# EAGLE design TokyoTime (EAGLE 5.11)
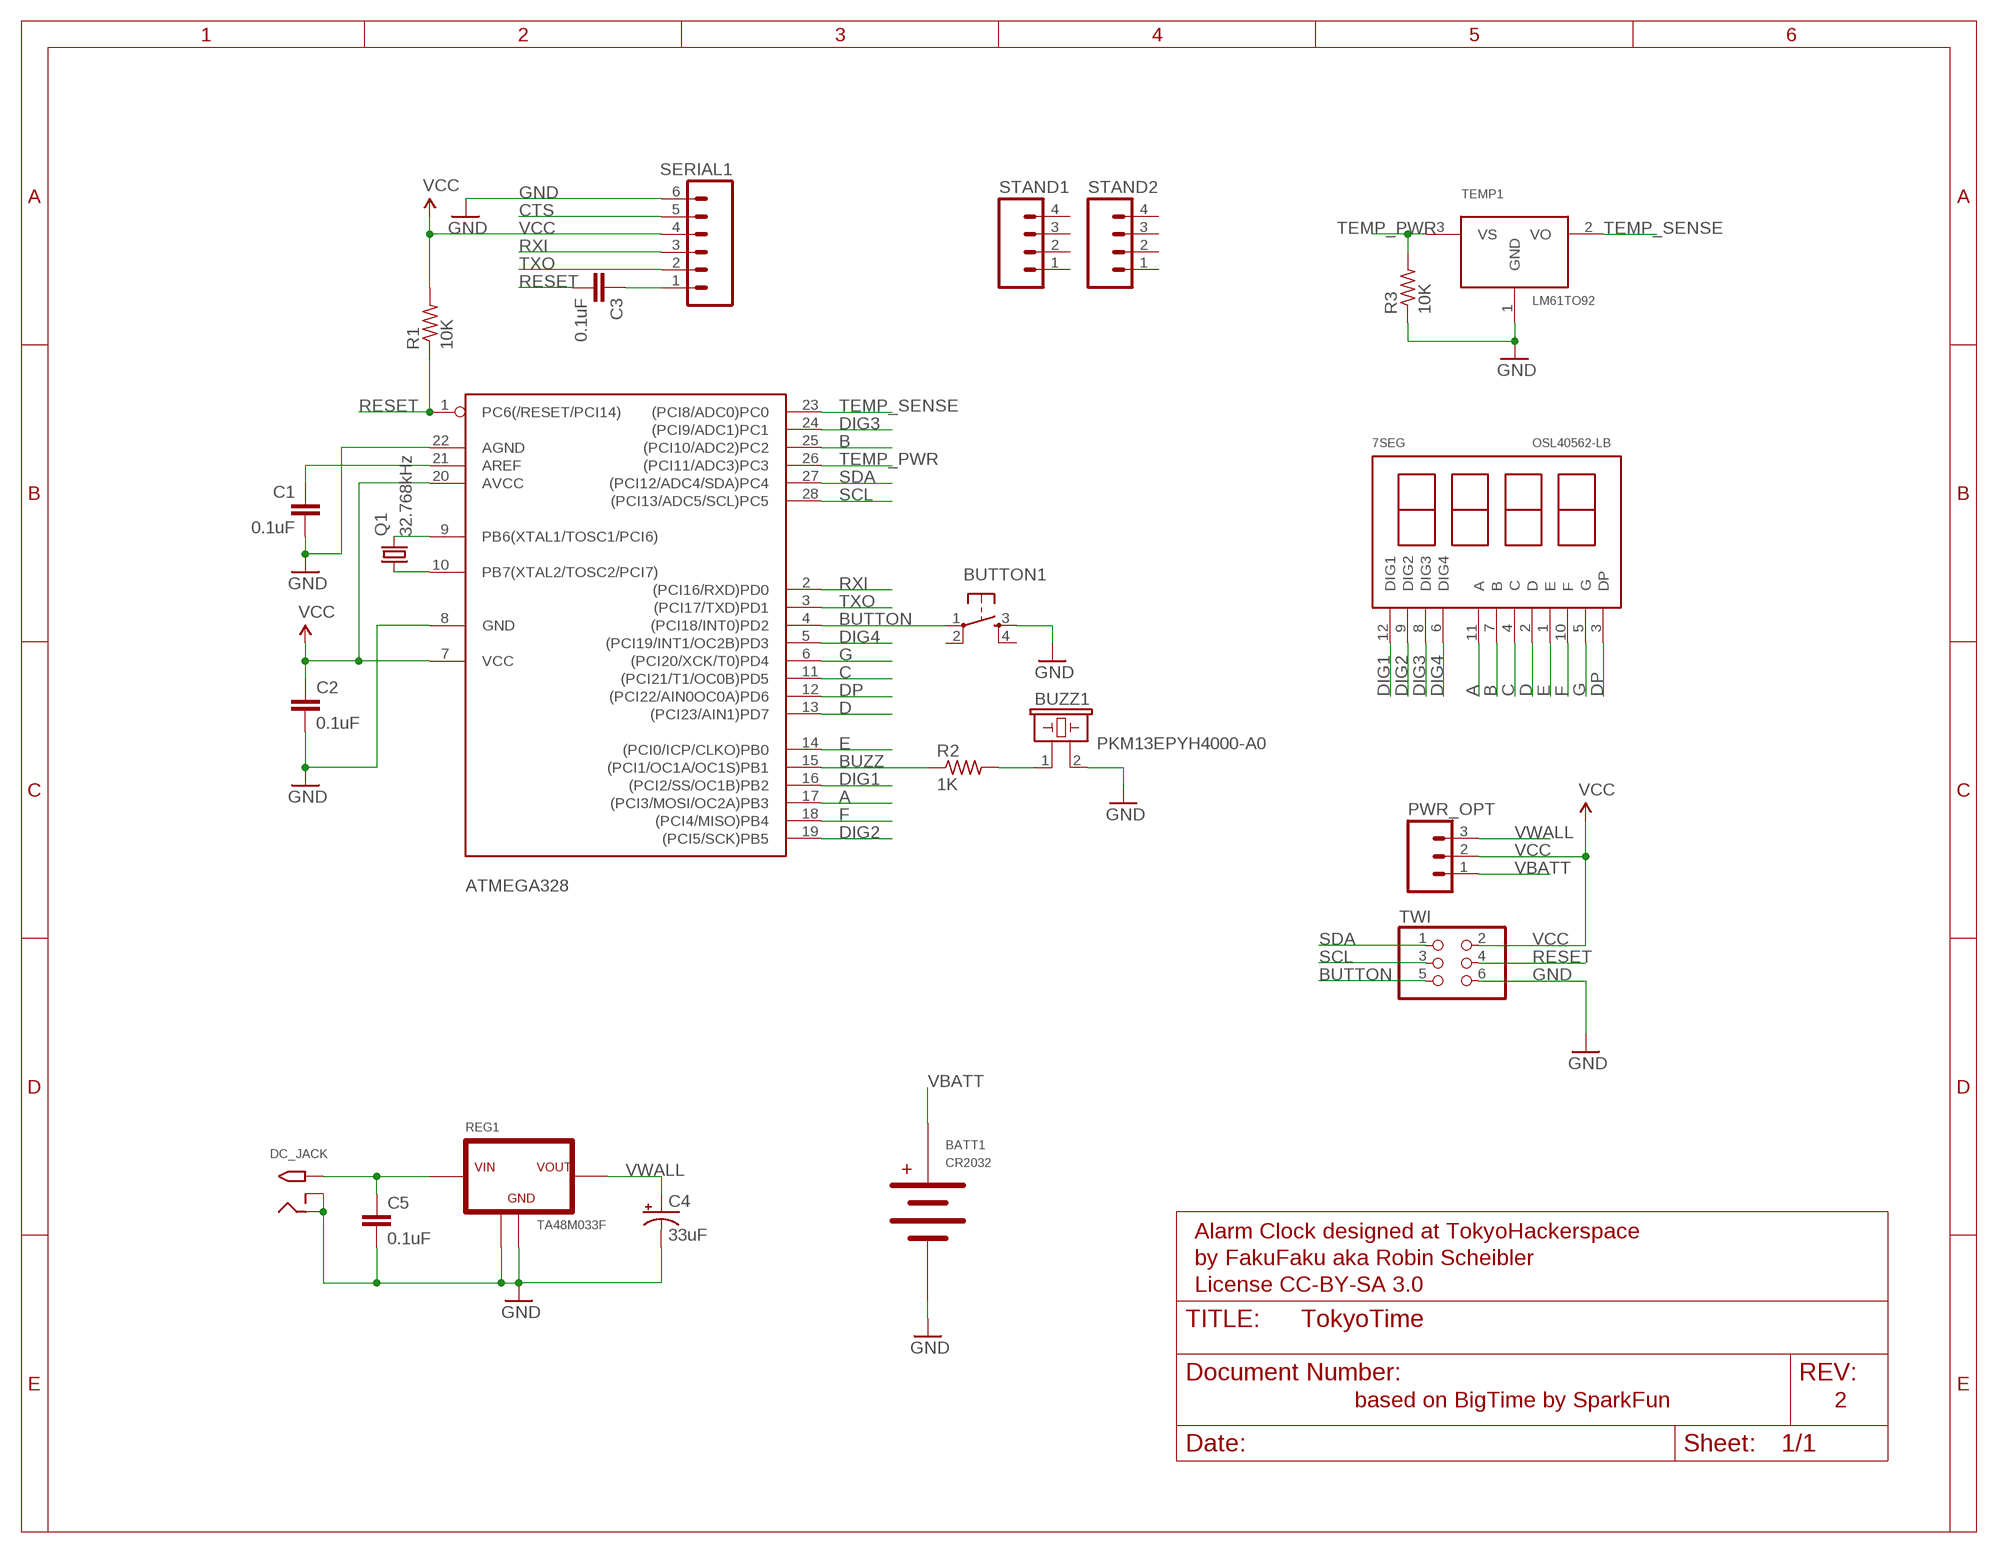
[diagram p0: schematic, sheet 1]

## Parts
7SEG  OSL40562-LB  7SEG  [OSL40562]
ATMEGA328  ATMEGA168-20P  [DIL28-3]
BATT1  CR2032  BATTERY-HOLDER  [CR2032-HOLDER-20MM]
BUTTON1  TAC_SWITCHPTH  [TACTILE-PTH]
BUZZ1  PKM13EPYH4000-A0  BUZZER13MM  [PIEZO-MURATA-13MM]
C1  0.1uF  CAPPTH  [CAP-PTH-SMALL]
C2  0.1uF  CAPPTH  [CAP-PTH-SMALL]
C3  0.1uF  CAPPTH  [CAP-PTH-SMALL]
C4  33uF  CAP_POLPTH2  [CPOL-RADIAL-10UF-25V]
C5  0.1uF  CAPPTH  [CAP-PTH-SMALL]
DC_JACK  2.1MMJACKTHM  [PJ-102A]
PWR_OPT  M03PTH  [1X03]
Q1  32.768kHz  CRYSTAL8X3  [CRYSTAL-8X3-TH]
R1  10K  R-US_0207/10  [0207/10]
R2  1K  R-US_0207/10  [0207/10]
R3  10K  R-US_0207/10  [0207/10]
REG1  TA48M033F  REGULATOR  [HSIP3-P-2.30B]
SERIAL1  M06SIP  [1X06]
STAND1  M04PTH  [1X04]
STAND2  M04PTH  [1X04]
TEMP1  LM61TO92  [TO92-]
TWI  PINHD-2X3  [2X03]

## Nets
A: 7SEG.11(A) ATMEGA328.17((PCI3/MOSI/OC2A)PB3)
B: 7SEG.7(B) ATMEGA328.25((PCI10/ADC2)PC2)
BUTTON: ATMEGA328.4((PCI18/INT0)PD2) BUTTON1.1 TWI.5
BUZZ: ATMEGA328.15((PCI1/OC1A/OC1S)PB1) R2.1
C: 7SEG.4(C) ATMEGA328.11((PCI21/T1/OC0B)PD5)
CTS: SERIAL1.5
D: 7SEG.2(D) ATMEGA328.13((PCI23/AIN1)PD7)
DIG1: 7SEG.12(DIG1) ATMEGA328.16((PCI2/SS/OC1B)PB2)
DIG2: 7SEG.9(DIG2) ATMEGA328.19((PCI5/SCK)PB5)
DIG3: 7SEG.8(DIG3) ATMEGA328.24((PCI9/ADC1)PC1)
DIG4: 7SEG.6(DIG4) ATMEGA328.5((PCI19/INT1/OC2B)PD3)
DP: 7SEG.3(DP) ATMEGA328.12((PCI22/AIN0OC0A)PD6)
E: 7SEG.1(E) ATMEGA328.14((PCI0/ICP/CLKO)PB0)
F: 7SEG.10(F) ATMEGA328.18((PCI4/MISO)PB4)
G: 7SEG.5(G) ATMEGA328.6((PCI20/XCK/T0)PD4)
GND: ATMEGA328.8(GND) ATMEGA328.22(AGND) BATT1.MINUS BUTTON1.3 BUZZ1.2 C1.2 C2.2 C4.2(-) C5.2 DC_JACK.RING DC_JACK.RING_SW R3.1 REG1.2(GND) REG1.HEATSINK(GND) SERIAL1.6 TEMP1.1(GND) TWI.6
N$1: ATMEGA328.9(PB6(XTAL1/TOSC1/PCI6)) Q1.2
N$2: ATMEGA328.10(PB7(XTAL2/TOSC2/PCI7)) Q1.1
N$3: C5.1 DC_JACK.TIP REG1.1(VIN)
N$4: ATMEGA328.21(AREF) C1.1
N$7: C3.1 SERIAL1.1
N$13: BUZZ1.1 R2.2
RESET: ATMEGA328.1(PC6(/RESET/PCI14)) C3.2 R1.1 TWI.4
RXI: ATMEGA328.2((PCI16/RXD)PD0) SERIAL1.3
SCL: ATMEGA328.28((PCI13/ADC5/SCL)PC5) TWI.3
SDA: ATMEGA328.27((PCI12/ADC4/SDA)PC4) TWI.1
TEMP_PWR: ATMEGA328.26((PCI11/ADC3)PC3) R3.2 TEMP1.3(VS)
TEMP_SENSE: ATMEGA328.23((PCI8/ADC0)PC0) TEMP1.2(VO)
TXO: ATMEGA328.3((PCI17/TXD)PD1) SERIAL1.2
VBATT: BATT1.PLUS PWR_OPT.1
VCC: ATMEGA328.7(VCC) ATMEGA328.20(AVCC) C2.1 PWR_OPT.2 R1.2 SERIAL1.4 TWI.2
VWALL: C4.1(+) PWR_OPT.3 REG1.3(VOUT)
Unconnected: BUTTON1.2 BUTTON1.4 STAND1.1 STAND1.2 STAND1.3 STAND1.4 STAND2.1 STAND2.2 STAND2.3 STAND2.4

## Notes on the sheet
- Alarm Clock designed at TokyoHackerspace
- by FakuFaku aka Robin Scheibler
- License CC-BY-SA 3.0
- based on BigTime by SparkFun | 2

## Library data of the parts
7SEG = Robin:7SEG
ATMEGA328 = adafruit:ATMEGA168*P: MICROCONTROLLER 16 kBytes FLASH 1 kBytes SRAM 512 Bytes EEPROM USART 8-channel 10 bit ADC
BATT1 = Robin:BATTERY-HOLDER
BUTTON1 = SparkFun:TAC_SWITCH: Momentary Switch Button commonly used for reset or general input. Spark Fun Electronics SKU : COM-00097
BUZZ1 = Robin:BUZZER: BUZZER Source: muRata
C1-C3 C5 = SparkFun:CAP: Capacitor Standard 0603 ceramic capacitor, and 0.1" leaded capacitor.
C4 = SparkFun:CAP_POL: Capacitor Polarized These are standard SMD and PTH capacitors. Normally 10uF, 47uF, and 100uF in electrolytic and tantalum varieties. Always verify the external diameter of the through hole cap, it varies with capacity, voltage, and manufacturer. The EIA devices should be standard.
DC_JACK = adafruit:2.1MMJACK: 2.1mm x 5.5mm THM DC jack with internal switch. Digikey part #PJ-102A, 4UCON part #05537 2.1mm x 5.5mm SMT DC jack with internal switch. Digikey part #PJ-002A-SMT, 4UCON part #03267 By microbuilder.eu & adafruit.com
PWR_OPT = SparkFun:M03: Header 3 Standard 3-pin 0.1" header. Use with straight break away headers (SKU : PRT-00116), right angle break away headers (PRT-00553), swiss pins (PRT-00743), machine pins (PRT-00117), and female headers (PRT-00115). Molex polarized connector foot print use with SKU : PRT-08232 with associated crimp pins and housings.
Q1 = Robin:CRYSTAL
R1-R3 = adafruit:R-US_: RESISTOR, American symbol
REG1 = Robin:REGULATOR
SERIAL1 = SparkFun:M06: Header 6 Standard 6-pin 0.1" header. Use with straight break away headers (SKU : PRT-00116), right angle break away headers (PRT-00553), swiss pins (PRT-00743), machine pins (PRT-00117), and female headers (PRT-00115). Molex polarized connector foot print use with SKU : PRT-08094 with associated crimp pins and housings. NOTES ON THE VARIANTS LOCK and LOCK_LONGPADS... This footprint was designed to help hold the alignment of a through-hole component (i.e. 6-pin header) while soldering it into place. You may notice that each hole has been shifted either up or down by 0.005 of an inch from it's more standard position (which is a perfectly straight line). This slight alteration caused the pins (the squares in the middle) to touch the edges of the holes. Because they are alternating, it causes a "brace" to hold the component in place. 0.005 has proven to be the perfect amount of "off-center" position when using our standard breakaway headers. Although looks a little odd when you look at the bare footprint, once you have a header in there, the alteration is very hard to notice. Also, if you push a header all the way into place, it is covered up entirely on the bottom side. This idea of altering the position of holes to aid alignment will be further integrated into the Sparkfun Library for other footprints. It can help hold any component with 3 or more connection pins.
STAND1 STAND2 = SparkFun:M04: Header 4 Standard 4-pin 0.1" header. Use with straight break away headers (SKU : PRT-00116), right angle break away headers (PRT-00553), swiss pins (PRT-00743), machine pins (PRT-00117), and female headers (PRT-00115). Molex polarized connector foot print use with SKU : PRT-08231 with associated crimp pins and housings.
TEMP1 = Robin:LM61: The LM61 is a precision integrated-circuit temperature sensor that can sense a ?30°C to +100°C temperature range while operating from a single +2.7V supply. The LM61's output volt- age is linearly proportional to Celsius (Centigrade) tempera- ture (+10 mV/°C) and has a DC offset of +600 mV. The offset allows reading negative temperatures without the need for a negative supply. The nominal output voltage of the LM61 ranges from +300 mV to +1600 mV for a ?30°C to +100°C temperature range. The LM61 is calibrated to provide accu- racies of ±2.0°C at room temperature and ±3°C over the full ?25°C to +85°C temperature range.
TWI = pinhead:PINHD-2X3: PIN HEADER

## Board
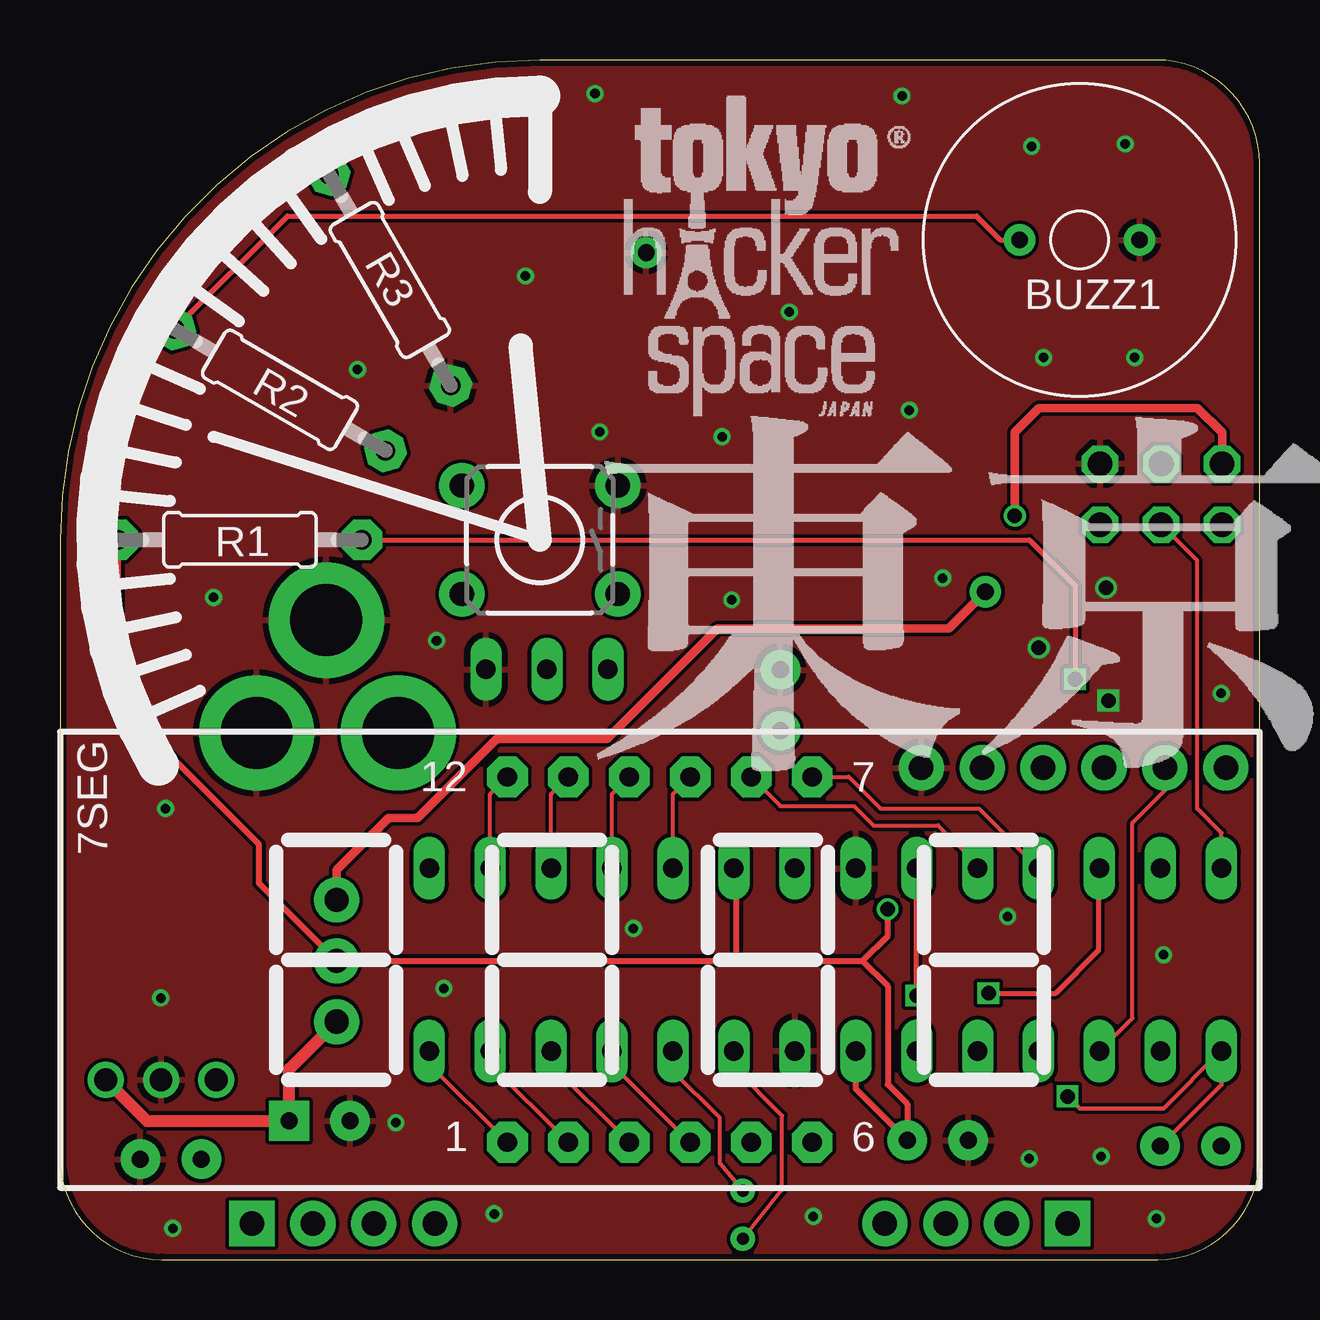
[diagram p1: board, top side]
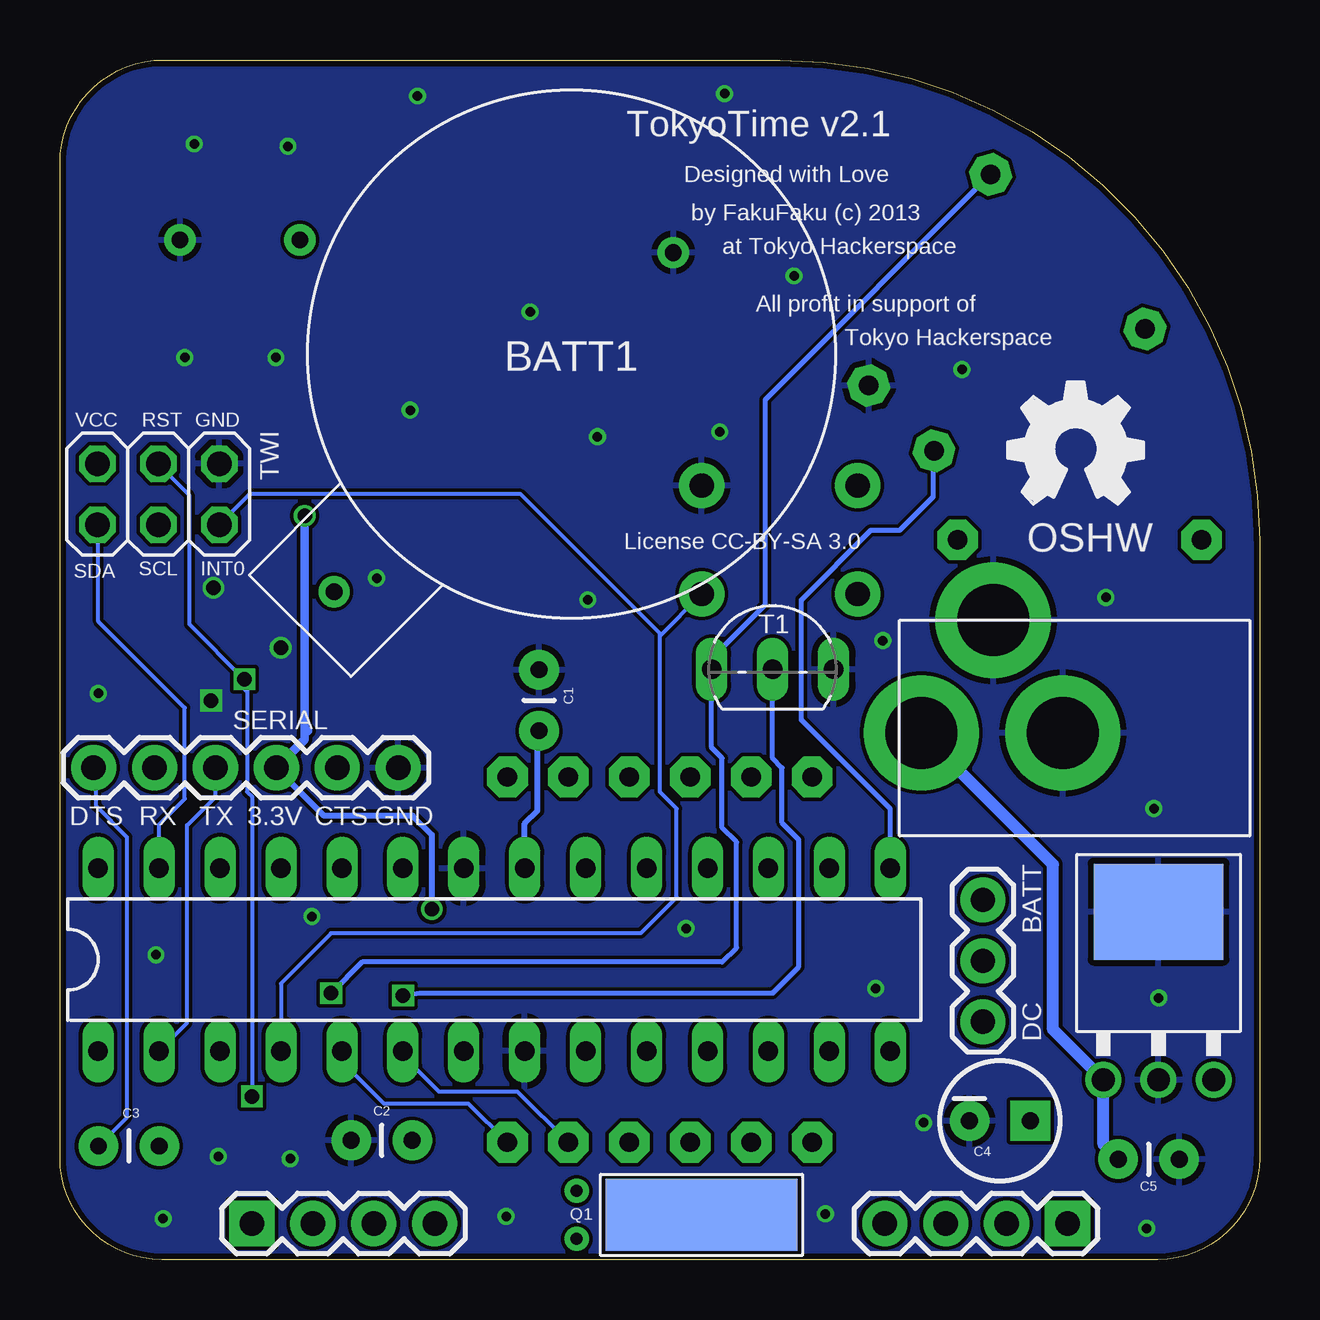
[diagram p2: board, bottom side, seen from below]

Size 50 x 50 mm. Coordinates in mm from the lower left corner, seen from the top.
Outline: 50,45.69 arc90 45.69,50 20,50 arc90 0,30 0,4.24 arc90 4.24,0 45.76,0 arc90 50,4.24 50,45.69
Copper layers (1*16): Top 0.035mm / dielectric 1.5mm / Bottom 0.035mm
Design rules "Fusion_eagle_rule_v1.1": minimum track width 6mil, minimum drill 12mil, track to track 6mil, track to pad 6mil, pad to pad 6mil, via to via 6mil, smd to smd 0mil, copper to edge 10mil, drill to drill 10mil, minimum pad ring 10mil, minimum via ring 6mil, stop-mask expansion 2mil, vias tented up to drill 100mil, thermal gap 10mil

### Footprints (pad centres in the part's own frame; a part is rotated, then mirrored left to right if it is on the bottom)
OSL40562 = drill 0.8 pad 1.7 octagon: 1 -6.35,-7.62; 2 -3.81,-7.62; 3 -1.27,-7.62; 4 1.27,-7.62; 5 3.81,-7.62; 6 6.35,-7.62; 7 6.35,7.62; 8 3.81,7.62; 9 1.27,7.62; 10 -1.27,7.62; 11 -3.81,7.62; 12 -6.35,7.62
DIL28-3 = drill 0.813 long: 1 -16.51,-3.81; 2 -13.97,-3.81; 3 -11.43,-3.81; 4 -8.89,-3.81; 5 -6.35,-3.81; 6 -3.81,-3.81; 7 -1.27,-3.81; 8 1.27,-3.81; 9 3.81,-3.81; 10 6.35,-3.81; 11 8.89,-3.81; 12 11.43,-3.81; 13 13.97,-3.81; 14 16.51,-3.81; 15 16.51,3.81; 16 13.97,3.81; 17 11.43,3.81; 18 8.89,3.81; 19 6.35,3.81; 20 3.81,3.81; 21 1.27,3.81; 22 -1.27,3.81; 23 -3.81,3.81; 24 -6.35,3.81; 25 -8.89,3.81; 26 -11.43,3.81; 27 -13.97,3.81; 28 -16.51,3.81
CR2032-HOLDER-20MM = drill 0.7 pad 1.3 round: MINUS -6,0; PLUS 14,0
TACTILE-PTH = drill 1.016 pad 1.88 round: 1 -3.251,2.261; 2 3.251,2.261; 3 -3.251,-2.261; 4 3.251,-2.261
PIEZO-MURATA-13MM = drill 0.7 pad 1.3 round: 1 -2.5,0; 2 2.5,0
CAP-PTH-SMALL = drill 0.7 pad 1.651 round: 1 0,0; 2 2.54,0
CPOL-RADIAL-10UF-25V = drill 0.7 pad 1.651 square: 1 1.27,0 | drill 0.7 pad 1.651 round: 2 -1.27,0
PJ-102A = drill 3 pad 4.8 round: RING 0.1,-3.39; RING_SW -4.6,-6.29; TIP 0.1,-9.29
1X03 = drill 1.016 pad 1.88 round: 1 0,0; 2 2.54,0; 3 5.08,0
CRYSTAL-8X3-TH = drill 0.5 pad 0.8 round: 1 -1,-1.2; 2 1,-1.2 | smd 3 x 8: PLATE 0,4
0207/10 = drill 0.813 pad 1.676 octagon: 1 -5.08,0; 2 5.08,0
HSIP3-P-2.30B = drill 0.95 pad 1.5 round: 1 -2.3,0; 2 0,0; 3 2.3,0 | smd 5.4 x 4: HEATSINK 0,7
1X06 = drill 1.016 pad 1.88 round: 1 0,0; 2 2.54,0; 3 5.08,0; 4 7.62,0; 5 10.16,0; 6 12.7,0
1X04 = drill 1.016 pad 1.88 square: 1 0,0 | drill 1.016 pad 1.88 round: 2 2.54,0; 3 5.08,0; 4 7.62,0
TO92- = drill 0.813 long: 1 2.54,0; 2 0,0; 3 -2.54,0
2X03 = drill 1.016 octagon: 1 -2.54,-1.27; 2 -2.54,1.27; 3 0,-1.27; 4 0,1.27; 5 2.54,-1.27; 6 2.54,1.27

### Placement (x,y rotation side)
7SEG  25,12.5 0 top
ATMEGA328  31.9,12.5 0 bottom
BATT1  28.68,37.73 225 bottom
BUTTON1  20,30 180 top
BUZZ1  42.5,42.5 0 top
C1  30.03,22.04 90 bottom
C2  35.32,4.97 180 bottom
C3  48.4,4.73 0 bottom
C4  10.82,5.78 0 bottom
C5  5.89,4.18 0 bottom
DC_JACK  4.81,22.05 270 bottom
PWR_OPT  11.53,14.99 270 bottom
Q1  27.26,1.86 270 bottom
R1  7.5,30 180 top
R2  9.17,36.25 150 top
R3  13.75,40.83 120 top
REG1  4.21,7.49 0 bottom
SERIAL1  48.6,20.5 0 bottom
STAND1  8,1.5 180 bottom
STAND2  42,1.5 0 bottom
TEMP1  20.3,24.6 0 bottom
TWI  45.9,31.9 0 bottom
U$1  [THS]  19.6,32.2 0 top
U$2  [TOKYO]  22.32,20.34 0 top
U$3  [OSHW_FILLX200_NOTEXT]  10.5,31.5 0 bottom

### Tracks (layer width: path | path; a pad name or v marks a point on that pad's centre or on a via)
A
  Top 0.16: ATMEGA328.17 20.47,19.4 7SEG.11
B
  Top 0.16: 7SEG.7 32.88,20.12 34.2,18.8 38.3,18.8 ATMEGA328.25
BUTTON
  Bottom 0.16: ATMEGA328.4 40.79,11.51 38.7,13.6 25.8,13.6 24.3,15.1 24.3,18.8 25,19.5 25,25.99 | 25,25.99 BUTTON1.1 | 25,25.99 25,26.1 30.8,31.9 42.09,31.9 TWI.5
BUZZ
  Bottom 0.2: ATMEGA328.15 15.39,18.79 19.1,22.5 19.1,27.5 16.2,30.4 15,30.4 13.6,31.8 13.6,33.68 R2.1
C
  Top 0.16: ATMEGA328.11 23.01,8.14 7SEG.4
D
  Top 0.16: ATMEGA328.13 17.93,8.14 7SEG.2
DIG1
  Top 0.16: ATMEGA328.16 17.93,19.4 7SEG.12
DIG2
  Top 0.16: ATMEGA328.19 25.55,19.4 7SEG.9
DIG3
  Top 0.16: 7SEG.8 30.03,18.9 33.1,18.9 33.9,18.1 36.6,18.1 38.25,16.45 ATMEGA328.24
DIG4
  Bottom 0.16: 7SEG.6 32.97,6.5 36.5,6.5 38.25,8.25 ATMEGA328.5
DP
  Top 0.16: ATMEGA328.12 20.47,8.14 7SEG.3
E
  Top 0.16: ATMEGA328.14 15.39,8.14 7SEG.1
F
  Top 0.16: ATMEGA328.18 23.01,19.4 7SEG.10
G
  Bottom 0.16: 7SEG.5 30.93,7 34.2,7 35.71,8.51 ATMEGA328.6
GND  (via drill 0.4, 0.6)
  other vias: 43.7,23.3 40.8,25.5 43.6,28 19.4,41 35.1,48.5 22.3,48.6 22.5,34.5 27.6,34.3 35.4,35.4 30.4,39.5 40.5,46.4 44.4,46.5 44.8,37.6 41,37.6 36.8,28.4 28,27.5 15.7,25.8 6.4,27.6 12.4,37.1 48.4,23.6 46,12.7 16,11.3 23.9,13.8 4.2,10.9 4.4,18.8 40.4,4.2 43.4,4.3 45.7,1.7 31.4,1.8 18.1,1.9 14,5.7 4.7,1.3 39.5,14.3
  pour Bottom: -15.7,-3.2 67.1,-3.2 67.1,51.5 -15.8,51.5
  pour Top: -4.7,53.1 -4.7,-10.9 55.7,-10.9 55.7,53.2 -4.7,53.2
N$1
  Top 0.16: Q1.2 30.1,2.9 30.1,6 28.09,8.01 ATMEGA328.9
N$2
  Top 0.16: Q1.1 27.5,4.02 27.5,5.9 25.55,7.85 ATMEGA328.10
N$3
  Bottom 0.5: DC_JACK.TIP 8.61,16.46 8.61,9.59 REG1.1 6.51,4.8 C5.1
N$4
  Bottom 0.25: ATMEGA328.21 30.63,18.17 30.1,18.7 30.1,21.97 C1.1
N$7
  Bottom 0.16: SERIAL1.1 48.6,20.3 48.5,20.2 48.5,18.9 47.2,17.6 47.2,5.93 C3.1
N$13
  Top 0.2: R2.2 9.48,43.5 38.2,43.5 39.2,42.5 BUZZ1.1
RESET  (via drill 0.6)
  Top 0.16: C3.2 48.41,7.28 ATMEGA328.1 48.39,8.69 46,6.3 42.5,6.3 v42,6.8
  Top 0.2: R1.1 40.4,30 42.31,28.09 v42.31,24.18
  Bottom 0.16: v42,6.8 42,19.3 42.2,19.5 42.2,23.7 42.2,24.07 v42.31,24.18 44.6,26.47 44.6,31.84 45.93,33.17
  Bottom 0.2: v42.31,24.18 42.31,23.82 42.2,23.7
  Bottom 0.25: 45.93,33.17 TWI.4
RXI
  Bottom 0.16: SERIAL1.3 43.52,19.28 44.7,18.1 44.7,9.86 ATMEGA328.2
SCL
  Top 0.16: ATMEGA328.28 48.41,17.79 47.4,18.8 47.4,29.13 TWI.3
SDA
  Bottom 0.16: ATMEGA328.27 45.87,18.13 44.8,19.2 44.8,23 48.4,26.6 48.4,30.59 TWI.1
TEMP_PWR  (via drill 0.6)
  Top 0.2: v38.7,11.1 41.5,11.1 43.3,12.9 43.3,16.28 ATMEGA328.26
  Bottom 0.2: v38.7,11.1 37.4,12.4 22.4,12.4 21.8,13 21.8,17.4 22.4,18 22.4,20.9 22.84,21.34 TEMP1.3 22.84,25.06 20.6,27.3 20.6,35.84 R3.2
TEMP_SENSE  (via drill 0.6)
  Top 0.2: v35.7,11 ATMEGA328.23
  Bottom 0.2: TEMP1.2 20.3,20.9 19.9,20.5 19.9,18.2 19.2,17.5 19.2,12.2 20.3,11.1 35,11.1 v35.7,11
TXO
  Top 0.16: SERIAL1.2 46.06,19.56 44.7,18.2 44.7,10.06 ATMEGA328.3
VBATT
  Top 0.35: PWR_OPT.1 11.53,16.23 13.7,18.4 14.9,18.4 18.2,21.7 22.8,21.7 27.4,26.3 37.05,26.3 BATT1.PLUS
VCC  (via drill 0.6)
  Top 0.25: 33.45,12.45 34.5,11.4 34.5,7.3 35.32,6.48 C2.1 33.17,7.12 ATMEGA328.7 | 28.2,12.45 PWR_OPT.2 8.3,15.68 8.3,17.3 2.42,23.18 R1.2 | 28.2,12.45 33.45,12.45 | ATMEGA328.20 28.2,16.2 28.2,12.45 | 33.45,12.45 34.5,13.5 v34.5,14.6
  Top 0.35: TWI.2 48.44,34.46 47.4,35.5 40.8,35.5 39.8,34.5 v39.8,31
  Bottom 0.25: v34.5,14.6 34.5,17.7 35.3,18.5 38.98,18.5 SERIAL1.4
  Bottom 0.35: 39.8,21.9 39.8,21.68 SERIAL1.4 | 39.8,21.9 v39.8,31 | 39.8,21.9 39.66,22.04
VWALL
  Top 0.5: REG1.3 3.62,5.78 C4.1 9.55,7.93 PWR_OPT.3

### Text on the board
bPlace: TokyoTime v2.1 | Designed with Love | by FakuFaku (c) 2013 | at Tokyo Hackerspace | All profit in support of | Tokyo Hackerspace | GND | RST | VCC | OSHW | License CC-BY-SA 3.0 | INT0 | SCL | SDA | T1 | SERIAL | GND | CTS | 3.3V | TX | RX | DTS | BATT | DC